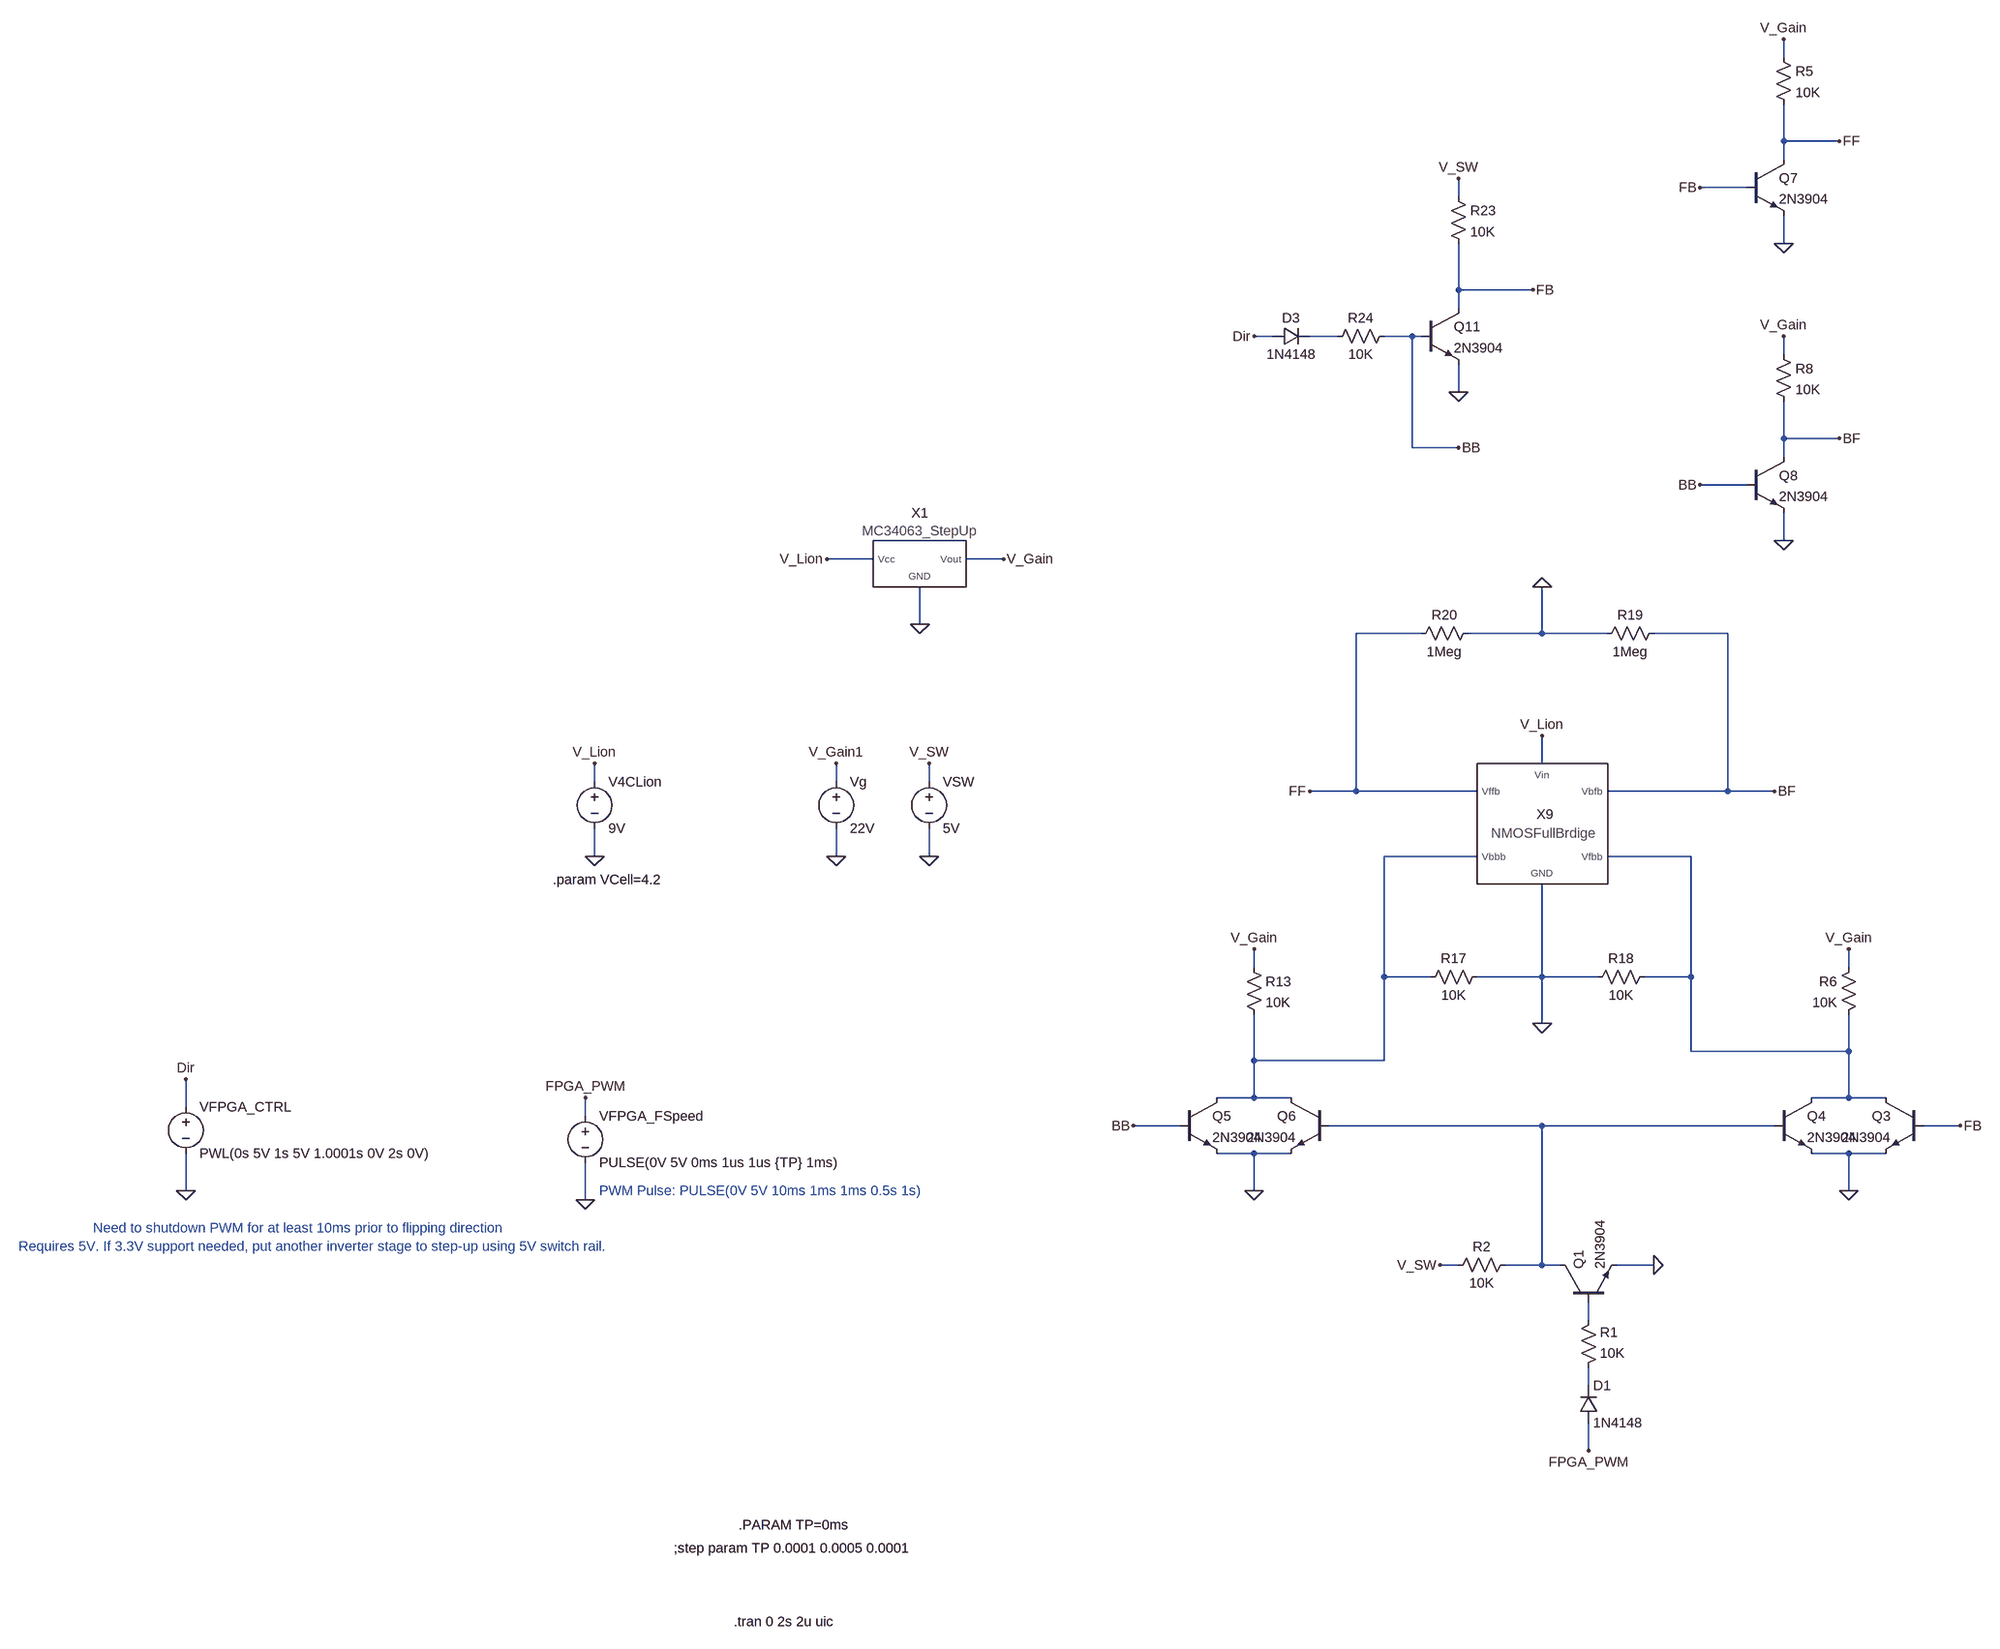
[diagram p0: schematic MotorController.asc]
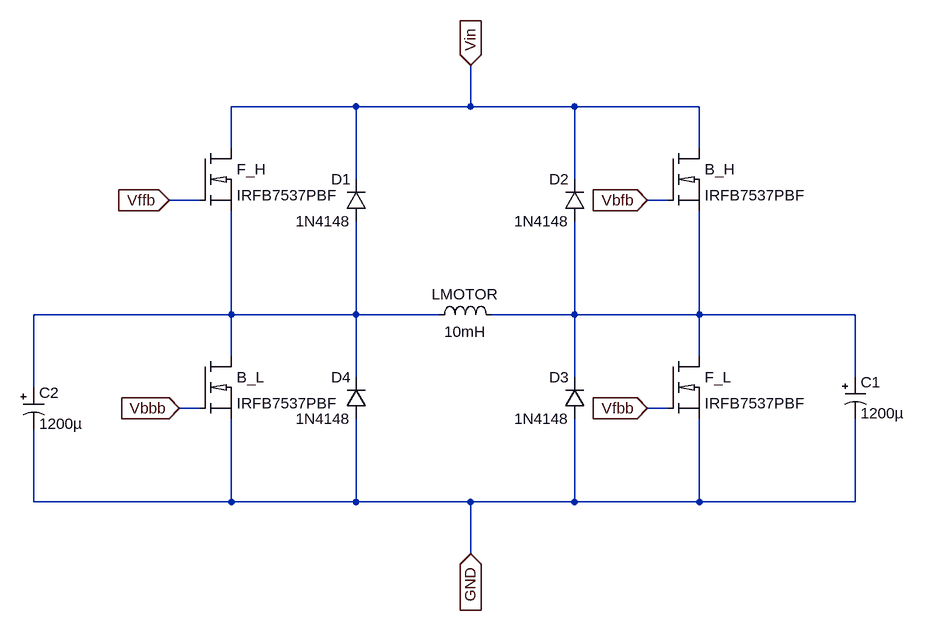
[diagram p1: sub-circuit nmosfullbridge.asc]
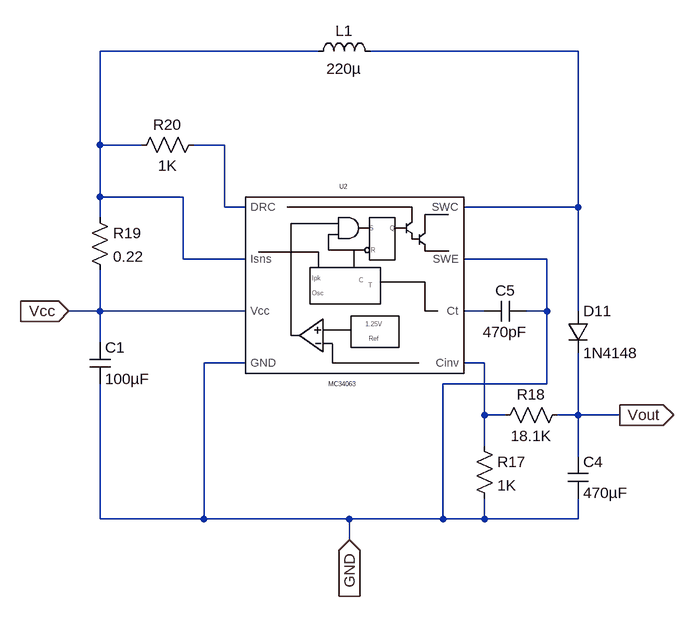
[diagram p2: sub-circuit mc34063_stepup.asc]
MotorController.asc, the LTspice schematic file:
Version 4
SHEET 1 2712 2204
WIRE 848 -1600 848 -1632
WIRE 848 -1456 848 -1520
WIRE 944 -1456 848 -1456
WIRE 848 -1424 848 -1456
WIRE 784 -1376 704 -1376
WIRE 288 -1360 288 -1392
WIRE 848 -1280 848 -1328
WIRE 288 -1200 288 -1280
WIRE 416 -1200 288 -1200
WIRE 288 -1168 288 -1200
WIRE -32 -1120 -64 -1120
WIRE 80 -1120 32 -1120
WIRE 208 -1120 160 -1120
WIRE 224 -1120 208 -1120
WIRE 848 -1088 848 -1120
WIRE 288 -1024 288 -1072
WIRE 848 -944 848 -1008
WIRE 944 -944 848 -944
WIRE 208 -928 208 -1120
WIRE 288 -928 208 -928
WIRE 848 -912 848 -944
WIRE 784 -864 704 -864
WIRE 848 -768 848 -816
WIRE -1088 -736 -1168 -736
WIRE -864 -736 -928 -736
WIRE -1008 -624 -1008 -688
WIRE 224 -608 112 -608
WIRE 432 -608 432 -688
WIRE 432 -608 304 -608
WIRE 544 -608 432 -608
WIRE 752 -608 624 -608
WIRE 432 -384 432 -432
WIRE -1568 -352 -1568 -384
WIRE -1152 -352 -1152 -384
WIRE -992 -352 -992 -384
WIRE 112 -336 112 -608
WIRE 112 -336 32 -336
WIRE 320 -336 112 -336
WIRE 752 -336 752 -608
WIRE 752 -336 544 -336
WIRE 832 -336 752 -336
WIRE -1568 -224 -1568 -272
WIRE -1152 -224 -1152 -272
WIRE -992 -224 -992 -272
WIRE 320 -224 160 -224
WIRE 688 -224 544 -224
WIRE -64 -32 -64 -64
WIRE 960 -32 960 -64
WIRE 160 -16 160 -224
WIRE 240 -16 160 -16
WIRE 432 -16 432 -176
WIRE 432 -16 320 -16
WIRE 528 -16 432 -16
WIRE 688 -16 688 -224
WIRE 688 -16 608 -16
WIRE 432 64 432 -16
WIRE 688 112 688 -16
WIRE 960 112 960 48
WIRE 960 112 688 112
WIRE -64 128 -64 48
WIRE 160 128 160 -16
WIRE 160 128 -64 128
WIRE -64 192 -64 128
WIRE -64 192 -128 192
WIRE 0 192 -64 192
WIRE 960 192 960 112
WIRE 960 192 896 192
WIRE 1024 192 960 192
WIRE -2272 208 -2272 160
WIRE -1584 224 -1584 192
WIRE -192 240 -272 240
WIRE 432 240 64 240
WIRE 832 240 432 240
WIRE 1152 240 1088 240
WIRE -64 288 -128 288
WIRE 0 288 -64 288
WIRE 960 288 896 288
WIRE 1024 288 960 288
WIRE -2272 352 -2272 288
WIRE -64 352 -64 288
WIRE 960 352 960 288
WIRE -1584 368 -1584 304
WIRE 288 480 256 480
WIRE 432 480 432 240
WIRE 432 480 368 480
WIRE 464 480 432 480
WIRE 624 480 560 480
WIRE 512 576 512 544
WIRE 512 688 512 656
WIRE 512 800 512 752
FLAG -1584 368 0
FLAG -1568 -224 0
FLAG -1568 -384 V_Lion
FLAG -1584 192 FPGA_PWM
FLAG 624 480 0
FLAG 512 800 FPGA_PWM
FLAG 960 352 0
FLAG -64 352 0
FLAG -2272 352 0
FLAG 432 -432 V_Lion
FLAG 432 64 0
FLAG -1152 -224 0
FLAG -1152 -384 V_Gain1
FLAG -992 -224 0
FLAG -992 -384 V_SW
FLAG -64 -64 V_Gain
FLAG 960 -64 V_Gain
FLAG 432 -688 0
FLAG -2272 160 Dir
FLAG 288 -1024 0
FLAG 288 -1392 V_SW
FLAG 256 480 V_SW
FLAG -64 -1120 Dir
FLAG 416 -1200 FB
FLAG 32 -336 FF
FLAG 1152 240 FB
FLAG 288 -928 BB
FLAG -272 240 BB
FLAG 832 -336 BF
FLAG 848 -1632 V_Gain
FLAG 848 -1280 0
FLAG 944 -1456 FF
FLAG 848 -1120 V_Gain
FLAG 848 -768 0
FLAG 944 -944 BF
FLAG 704 -864 BB
FLAG 704 -1376 FB
FLAG -1168 -736 V_Lion
FLAG -1008 -624 0
FLAG -864 -736 V_Gain
SYMBOL voltage -1584 208 R0
WINDOW 123 0 0 Left 2
WINDOW 39 0 0 Left 2
SYMATTR InstName VFPGA_FSpeed
SYMATTR Value PULSE(0V 5V 0ms 1us 1us {TP} 1ms)
SYMBOL voltage -1568 -368 R0
WINDOW 123 0 0 Left 2
WINDOW 39 0 0 Left 2
SYMATTR InstName V4CLion
SYMATTR Value 9V
SYMBOL npn 464 544 R270
SYMATTR InstName Q1
SYMATTR Value 2N3904
SYMBOL res 496 672 M180
WINDOW 0 36 76 Left 2
WINDOW 3 36 40 Left 2
SYMATTR InstName R1
SYMATTR Value 10K
SYMBOL res 272 496 R270
WINDOW 0 32 56 VTop 2
WINDOW 3 0 56 VBottom 2
SYMATTR InstName R2
SYMATTR Value 10K
SYMBOL npn 1088 192 M0
SYMATTR InstName Q3
SYMATTR Value 2N3904
SYMBOL res 976 -48 M0
SYMATTR InstName R6
SYMATTR Value 10K
SYMBOL npn 832 192 R0
SYMATTR InstName Q4
SYMATTR Value 2N3904
SYMBOL npn -192 192 R0
SYMATTR InstName Q5
SYMATTR Value 2N3904
SYMBOL res -80 -48 R0
SYMATTR InstName R13
SYMATTR Value 10K
SYMBOL npn 64 192 M0
SYMATTR InstName Q6
SYMATTR Value 2N3904
SYMBOL voltage -2272 192 R0
WINDOW 123 0 0 Left 2
WINDOW 39 0 0 Left 2
SYMATTR InstName VFPGA_CTRL
SYMATTR Value PWL(0s 5V 1s 5V 1.0001s 0V 2s 0V)
SYMBOL NMOSFullBridge 432 -272 R0
SYMATTR InstName X9
SYMBOL voltage -1152 -368 R0
WINDOW 123 0 0 Left 2
WINDOW 39 0 0 Left 2
SYMATTR InstName Vg
SYMATTR Value 22V
SYMBOL voltage -992 -368 R0
WINDOW 123 0 0 Left 2
WINDOW 39 0 0 Left 2
SYMATTR InstName VSW
SYMATTR Value 5V
SYMBOL res 224 0 R270
WINDOW 0 32 56 VTop 2
WINDOW 3 0 56 VBottom 2
SYMATTR InstName R17
SYMATTR Value 10K
SYMBOL res 624 -32 R90
WINDOW 0 0 56 VBottom 2
WINDOW 3 32 56 VTop 2
SYMATTR InstName R18
SYMATTR Value 10K
SYMBOL res 640 -624 R90
WINDOW 0 0 56 VBottom 2
WINDOW 3 32 56 VTop 2
SYMATTR InstName R19
SYMATTR Value 1Meg
SYMBOL res 208 -592 R270
WINDOW 0 32 56 VTop 2
WINDOW 3 0 56 VBottom 2
SYMATTR InstName R20
SYMATTR Value 1Meg
SYMBOL npn 224 -1168 R0
SYMATTR InstName Q11
SYMATTR Value 2N3904
SYMBOL res 272 -1376 R0
SYMATTR InstName R23
SYMATTR Value 10K
SYMBOL res 64 -1104 R270
WINDOW 0 32 56 VTop 2
WINDOW 3 0 56 VBottom 2
SYMATTR InstName R24
SYMATTR Value 10K
SYMBOL diode -32 -1136 M90
WINDOW 0 0 32 VBottom 2
WINDOW 3 32 32 VTop 2
SYMATTR InstName D3
SYMATTR Value 1N4148
SYMBOL npn 784 -1424 R0
SYMATTR InstName Q7
SYMATTR Value 2N3904
SYMBOL res 832 -1616 R0
SYMATTR InstName R5
SYMATTR Value 10K
SYMBOL npn 784 -912 R0
SYMATTR InstName Q8
SYMATTR Value 2N3904
SYMBOL res 832 -1104 R0
SYMATTR InstName R8
SYMATTR Value 10K
SYMBOL MC34063_StepUp -1008 -736 R0
SYMATTR InstName X1
SYMBOL diode 496 752 M180
WINDOW 0 24 64 Left 2
WINDOW 3 24 0 Left 2
SYMATTR InstName D1
SYMATTR Value 1N4148
TEXT -1328 1096 Left 2 !.tran 0 2s 2u uic
TEXT -1560 352 Left 2 ;PWM Pulse: PULSE(0V 5V 10ms 1ms 1ms 0.5s 1s)
TEXT -1640 -184 Left 2 !.param VCell=4.2
TEXT -1432 968 Left 2 !;step param TP 0.0001 0.0005 0.0001
TEXT -1320 928 Left 2 !.PARAM TP=0ms
TEXT -2560 448 Left 2 ;Requires 5V. If 3.3V support needed, put another inverter stage to step-up using 5V switch rail.
TEXT -2432 416 Left 2 ;Need to shutdown PWM for at least 10ms prior to flipping direction

nmosfullbridge.asc, the sub-circuit schematic file:
Version 4
SHEET 1 2712 2204
WIRE 1664 -576 1472 -576
WIRE 1840 -576 1840 -640
WIRE 1840 -576 1664 -576
WIRE 2000 -576 1840 -576
WIRE 2192 -576 2000 -576
WIRE 1472 -512 1472 -576
WIRE 2192 -512 2192 -576
WIRE 1664 -464 1664 -576
WIRE 2000 -464 2000 -576
WIRE 1424 -432 1376 -432
WIRE 2144 -432 2112 -432
WIRE 1472 -256 1472 -416
WIRE 1472 -256 1168 -256
WIRE 1664 -256 1664 -400
WIRE 1664 -256 1472 -256
WIRE 1792 -256 1664 -256
WIRE 2000 -256 2000 -400
WIRE 2000 -256 1872 -256
WIRE 2192 -256 2192 -416
WIRE 2192 -256 2000 -256
WIRE 2432 -256 2192 -256
WIRE 1472 -192 1472 -256
WIRE 2192 -192 2192 -256
WIRE 1664 -160 1664 -256
WIRE 2000 -160 2000 -256
WIRE 2432 -160 2432 -256
WIRE 1168 -144 1168 -256
WIRE 1424 -112 1392 -112
WIRE 2144 -112 2112 -112
WIRE 1168 32 1168 -80
WIRE 1472 32 1472 -96
WIRE 1472 32 1168 32
WIRE 1664 32 1664 -96
WIRE 1664 32 1472 32
WIRE 1840 32 1664 32
WIRE 2000 32 2000 -96
WIRE 2000 32 1840 32
WIRE 2192 32 2192 -96
WIRE 2192 32 2000 32
WIRE 2432 32 2432 -96
WIRE 2432 32 2192 32
WIRE 1840 112 1840 32
FLAG 1840 -640 Vin
IOPIN 1840 -640 In
FLAG 1376 -432 Vffb
IOPIN 1376 -432 In
FLAG 2112 -432 Vbfb
IOPIN 2112 -432 In
FLAG 2112 -112 Vfbb
IOPIN 2112 -112 In
FLAG 1392 -112 Vbbb
IOPIN 1392 -112 In
FLAG 1840 112 GND
IOPIN 1840 112 In
SYMBOL ind 1776 -240 R270
WINDOW 0 32 56 VTop 2
WINDOW 3 5 56 VBottom 2
SYMATTR InstName LMOTOR
SYMATTR Value 10mH
SYMATTR SpiceLine Ipk=173 Rser=2.5 Rpar=2.5 Cpar=0
SYMBOL IRFB7537PBF 1424 -512 R0
SYMATTR InstName F_H
SYMBOL IRFB7537PBF 1424 -192 R0
SYMATTR InstName B_L
SYMBOL IRFB7537PBF 2144 -512 R0
SYMATTR InstName B_H
SYMBOL IRFB7537PBF 2144 -192 R0
SYMATTR InstName F_L
SYMBOL diode 1680 -400 R180
WINDOW 0 24 64 Left 2
WINDOW 3 24 0 Left 2
SYMATTR InstName D1
SYMATTR Value 1N4148
SYMBOL diode 2016 -400 R180
WINDOW 0 24 64 Left 2
WINDOW 3 24 0 Left 2
SYMATTR InstName D2
SYMATTR Value 1N4148
SYMBOL diode 2016 -96 R180
WINDOW 0 24 64 Left 2
WINDOW 3 24 0 Left 2
SYMATTR InstName D3
SYMATTR Value 1N4148
SYMBOL diode 1680 -96 R180
WINDOW 0 24 64 Left 2
WINDOW 3 24 0 Left 2
SYMATTR InstName D4
SYMATTR Value 1N4148
SYMBOL polcap 2416 -160 R0
WINDOW 3 24 56 Left 2
SYMATTR Value 1200µ
SYMATTR InstName C1
SYMATTR Description Capacitor
SYMATTR Type cap
SYMATTR SpiceLine V=35 Irms=2.22 Rser=0.024 Lser=0 mfg="United Chemi-Con" pn="LXF35VB122M12X35LL" type="Al electrolytic"
SYMBOL polcap 1152 -144 R0
WINDOW 3 24 56 Left 2
SYMATTR Value 1200µ
SYMATTR InstName C2
SYMATTR Description Capacitor
SYMATTR Type cap
SYMATTR SpiceLine V=35 Irms=2.22 Rser=0.024 Lser=0 mfg="United Chemi-Con" pn="LXF35VB122M12X35LL" type="Al electrolytic"

mc34063_stepup.asc, the sub-circuit schematic file:
Version 4
SHEET 1 2712 2204
WIRE -1568 -1024 -1904 -1024
WIRE -1168 -1024 -1488 -1024
WIRE -1904 -880 -1904 -1024
WIRE -1840 -880 -1904 -880
WIRE -1712 -880 -1760 -880
WIRE -1904 -800 -1904 -880
WIRE -1776 -800 -1904 -800
WIRE -1712 -784 -1712 -880
WIRE -1680 -784 -1712 -784
WIRE -1168 -784 -1168 -1024
WIRE -1168 -784 -1344 -784
WIRE -1904 -768 -1904 -800
WIRE -1776 -704 -1776 -800
WIRE -1680 -704 -1776 -704
WIRE -1216 -704 -1344 -704
WIRE -1904 -624 -1904 -688
WIRE -1904 -624 -1952 -624
WIRE -1680 -624 -1904 -624
WIRE -1312 -624 -1344 -624
WIRE -1216 -624 -1216 -704
WIRE -1216 -624 -1248 -624
WIRE -1168 -624 -1168 -784
WIRE -1904 -576 -1904 -624
WIRE -1680 -544 -1744 -544
WIRE -1312 -544 -1344 -544
WIRE -1216 -512 -1216 -624
WIRE -1216 -512 -1376 -512
WIRE -1312 -464 -1312 -544
WIRE -1280 -464 -1312 -464
WIRE -1168 -464 -1168 -560
WIRE -1168 -464 -1200 -464
WIRE -1104 -464 -1168 -464
WIRE -1312 -416 -1312 -464
WIRE -1168 -400 -1168 -464
WIRE -1904 -304 -1904 -512
WIRE -1744 -304 -1744 -544
WIRE -1744 -304 -1904 -304
WIRE -1520 -304 -1744 -304
WIRE -1376 -304 -1376 -512
WIRE -1376 -304 -1520 -304
WIRE -1312 -304 -1312 -336
WIRE -1312 -304 -1376 -304
WIRE -1168 -304 -1168 -336
WIRE -1168 -304 -1312 -304
WIRE -1520 -272 -1520 -304
FLAG -1952 -624 Vcc
IOPIN -1952 -624 In
FLAG -1104 -464 Vout
IOPIN -1104 -464 Out
FLAG -1520 -272 GND
IOPIN -1520 -272 In
SYMBOL cap -1920 -576 R0
SYMATTR InstName C1
SYMATTR Value 100µF
SYMBOL cap -1184 -400 R0
SYMATTR InstName C4
SYMATTR Value 470µF
SYMBOL res -1328 -432 R0
SYMATTR InstName R17
SYMATTR Value 1K
SYMBOL res -1920 -784 R0
SYMATTR InstName R19
SYMATTR Value 0.22
SYMBOL ind -1584 -1008 R270
WINDOW 0 32 56 VTop 2
WINDOW 3 5 56 VBottom 2
SYMATTR InstName L1
SYMATTR Value 220µ
SYMATTR SpiceLine Ipk=0.1 Rser=3.612 Rpar=14130 Cpar=0 mfg="Coilcraft" pn="LPO4812-154"
SYMBOL cap -1312 -608 R270
WINDOW 0 32 32 VTop 2
WINDOW 3 0 32 VBottom 2
SYMATTR InstName C5
SYMATTR Value 470pF
SYMBOL diode -1184 -624 R0
SYMATTR InstName D11
SYMATTR Value 1N4148
SYMBOL res -1744 -896 R90
WINDOW 0 0 56 VBottom 2
WINDOW 3 32 56 VTop 2
SYMATTR InstName R20
SYMATTR Value 1K
SYMBOL MC34063 -1440 -688 R0
SYMATTR InstName U2
SYMBOL res -1184 -480 R90
WINDOW 0 0 56 VBottom 2
WINDOW 3 32 56 VTop 2
SYMATTR InstName R18
SYMATTR Value 18.1K

The netlist it stands for:
* MotorController.asc
VFPGA_FSpeed FPGA_PWM 0 PULSE(0V 5V 0ms 1us 1us {TP} 1ms)
V4CLion V_Lion 0 9V
Q1 N004 N005 0 0 2N3904
R1 N006 N005 10K
R2 V_SW N004 10K
Q3 N003 FB 0 0 2N3904
R6 V_Gain N003 10K
Q4 N003 N004 0 0 2N3904
Q5 N002 BB 0 0 2N3904
R13 V_Gain N002 10K
Q6 N002 N004 0 0 2N3904
VFPGA_CTRL Dir 0 PWL(0s 5V 1s 5V 1.0001s 0V 2s 0V)
XX9 N002 BF N003 FF V_Lion 0 nmosfullbridge
Vg V_Gain1 0 22V
VSW V_SW 0 5V
R17 N002 0 10K
R18 N003 0 10K
R19 BF 0 1Meg
R20 FF 0 1Meg
Q11 FB BB 0 0 2N3904
R23 V_SW FB 10K
R24 N001 BB 10K
D3 Dir N001 1N4148
Q7 FF FB 0 0 2N3904
R5 V_Gain FF 10K
Q8 BF BB 0 0 2N3904
R8 V_Gain BF 10K
XX1 V_Lion V_Gain 0 mc34063_stepup
D1 FPGA_PWM N006 1N4148

* block symbol definitions
.subckt nmosfullbridge Vbbb Vbfb Vfbb Vffb Vin GND
LMOTOR N001 N002 10mH Ipk=173 Rser=2.5 Rpar=2.5 Cpar=0
XF_H Vin Vffb N001 IRFB7537PBF  ; pins D G S
XB_L N001 Vbbb GND IRFB7537PBF  ; pins D G S
XB_H Vin Vbfb N002 IRFB7537PBF  ; pins D G S
XF_L N002 Vfbb GND IRFB7537PBF  ; pins D G S
D1 N001 Vin 1N4148
D2 N002 Vin 1N4148
D3 GND N002 1N4148
D4 GND N001 1N4148
C1 N002 GND 1200µ V=35 Irms=2.22 Rser=0.024 Lser=0 mfg="United Chemi-Con" pn="LXF35VB122M12X35LL" type="Al electrolytic"
C2 N001 GND 1200µ V=35 Irms=2.22 Rser=0.024 Lser=0 mfg="United Chemi-Con" pn="LXF35VB122M12X35LL" type="Al electrolytic"
.ends nmosfullbridge

.subckt mc34063_stepup Vcc Vout GND
C1 Vcc GND 100µF
C4 Vout GND 470µF
R17 N005 GND 1K
R19 N001 Vcc 0.22
L1 N001 N002 220µ Ipk=0.1 Rser=3.612 Rpar=14130 Cpar=0 mfg="Coilcraft" pn="LPO4812-154"
C5 N004 GND 470pF
D11 N002 Vout 1N4148
R20 N003 N001 1K
XU2 N002 GND N004 GND N005 Vcc N001 N003 MC34063  ; pins SWC SWE Ct GND Cinv Vcc Isns DRC
R18 Vout N005 18.1K
.ends mc34063_stepup

.model D D
.lib standard.dio
.model NPN NPN
.model PNP PNP
.lib standard.bjt
.tran 0 2s 2u uic
* PWM Pulse: PULSE(0V 5V 10ms 1ms 1ms 0.5s 1s)
.param VCell=4.2
;step param TP 0.0001 0.0005 0.0001
.PARAM TP=0ms
* Requires 5V. If 3.3V support needed, put another inverter stage to step-up using 5V switch rail.
* Need to shutdown PWM for at least 10ms prior to flipping direction
.lib .\IRFB7537PBF.cir
.lib .\MC34063.lib
.backanno
.end